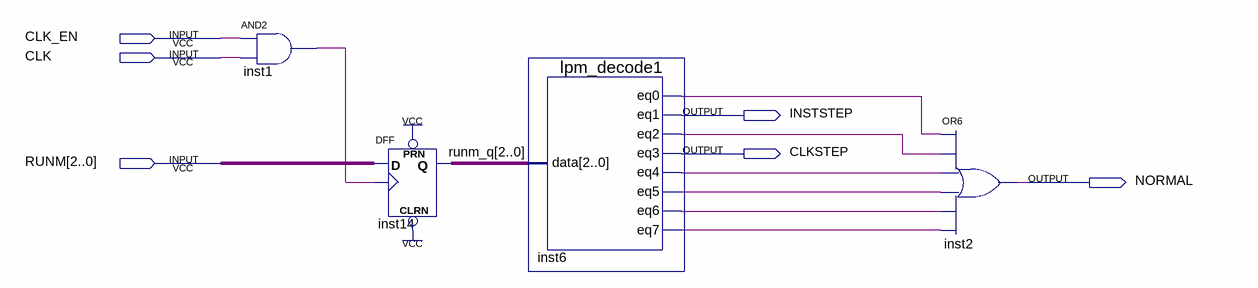
[diagram p0: schematic sheet]
// Quartus schematic runmode5.bdf as structural Verilog: 4 symbols, 6 pins
module runmode5 (
  input  CLK_EN,
  input  CLK,
  input  [2:0] RUNM,
  output INSTSTEP,
  output CLKSTEP,
  output NORMAL
);

  wire inst1_out, inst6_eq0, inst6_eq2, inst6_eq4, inst6_eq5, inst6_eq6, inst6_eq7;
  wire [2:0] runm_q;

  and inst1 (inst1_out, CLK_EN, CLK);
  DFF inst14[2:0] (.CLRN(1'b1), .CLK(inst1_out), .D(RUNM), .PRN(1'b1), .Q(runm_q));
  lpm_decode1 inst6 (
    .data(runm_q), .eq0(inst6_eq0), .eq1(INSTSTEP), .eq2(inst6_eq2), .eq3(CLKSTEP), .eq4(inst6_eq4),
    .eq5(inst6_eq5), .eq6(inst6_eq6), .eq7(inst6_eq7));
  or inst2 (NORMAL, inst6_eq0, inst6_eq2, inst6_eq4, inst6_eq5, inst6_eq6, inst6_eq7);
endmodule
